# EAGLE design slave (EAGLE 9.2.2)
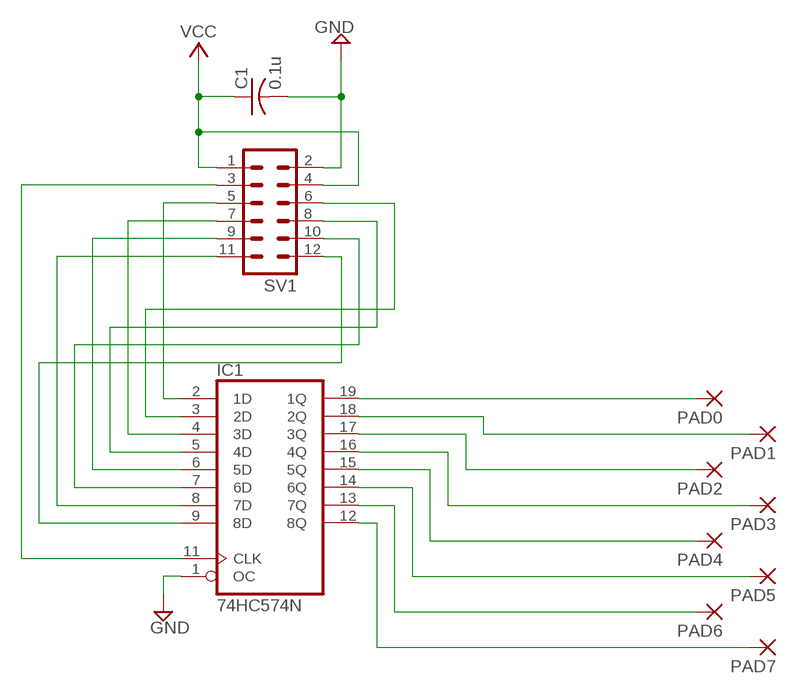
[diagram p0: schematic, sheet 1]

## Parts
C1  0.1u  C-USC0805  [C0805]
IC1  74HC574N  [DIL20]
PAD0  2,54/0,8  [2,54/0,8]
PAD1  2,54/0,8  [2,54/0,8]
PAD2  2,54/0,8  [2,54/0,8]
PAD3  2,54/0,8  [2,54/0,8]
PAD4  2,54/0,8  [2,54/0,8]
PAD5  2,54/0,8  [2,54/0,8]
PAD6  2,54/0,8  [2,54/0,8]
PAD7  2,54/0,8  [2,54/0,8]
SV1  MA06-2  [MA06-2]

## Nets
CLK: IC1.11(CLK) SV1.3
GND: C1.2 IC1.1(OC) SV1.2
IN0: IC1.2(1D) SV1.5
IN1: IC1.3(2D) SV1.6
IN2: IC1.4(3D) SV1.7
IN3: IC1.5(4D) SV1.8
IN4: IC1.6(5D) SV1.9
IN5: IC1.7(6D) SV1.10
IN6: IC1.8(7D) SV1.11
IN7: IC1.9(8D) SV1.12
N$1: IC1.19(1Q) PAD0.1(P)
N$2: IC1.18(2Q) PAD1.1(P)
N$3: IC1.17(3Q) PAD2.1(P)
N$4: IC1.16(4Q) PAD3.1(P)
N$5: IC1.15(5Q) PAD4.1(P)
N$6: IC1.14(6Q) PAD5.1(P)
N$7: IC1.13(7Q) PAD6.1(P)
N$8: IC1.12(8Q) PAD7.1(P)
VCC: C1.1 SV1.1 SV1.4

## Power pins joined to a net without a drawn wire
GND: IC1.10(GND)
VCC: IC1.20(VCC)

## Library data of the parts
C1 = rcl:C-US: CAPACITOR, American symbol; SPICEPREFIX: C
IC1 = 74xx-eu:74*574: 8-bit D type FLIP FLOP bus driver
PAD0 PAD1-PAD7 = wirepad:2,54/0,8: THROUGH-HOLE PAD
SV1 = con-lstb:MA06-2: PIN HEADER; OC_FARNELL: unknown; OC_NEWARK: unknown

## Board
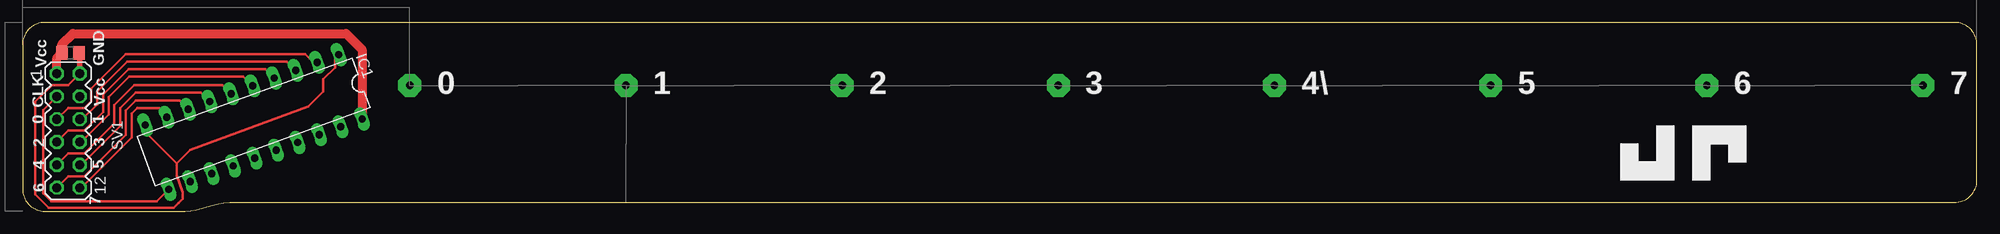
[diagram p1: board, top side]
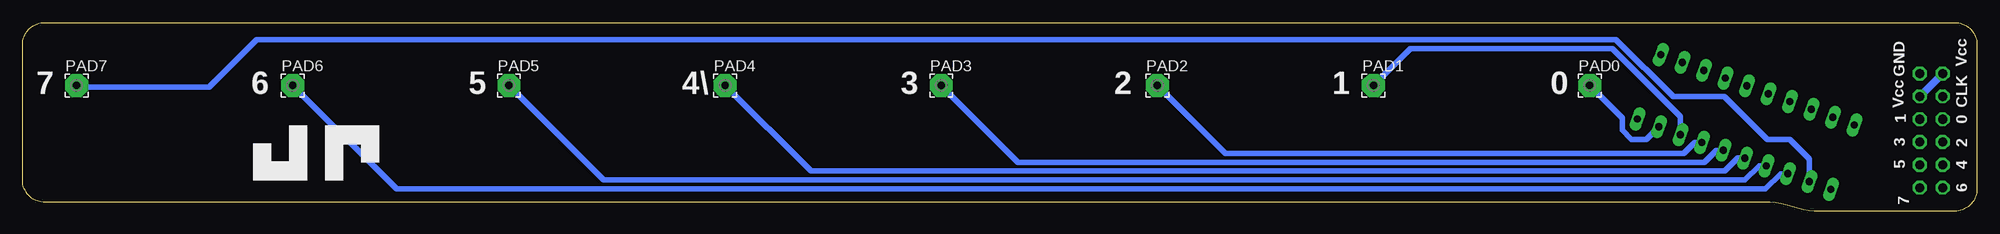
[diagram p2: board, bottom side, seen from below]

Size 217 x 21 mm. Coordinates in mm from the lower left corner, seen from the top.
Outline: 0,18.5 0,2.5 arc90 2.5,0 17.46,0 arc18 20.46,0.49 arc-18 23.62,1 214.5,1 arc90 217,3.4 217,18.5 arc90 214.5,21 2.5,21 arc90 0,18.5
Copper layers (1*16): Top 0.035mm / dielectric 1.5mm / Bottom 0.035mm
Design rules "default *": minimum track width 6mil, minimum drill 0.35mm, track to track 15mil, track to pad 15mil, pad to pad 15mil, via to via 15mil, smd to smd 6mil, copper to edge 10mil, drill to drill 6mil, minimum pad ring 10mil, minimum via ring 8mil, stop-mask expansion 4mil, vias tented up to drill 0mil, thermal gap 10mil

### Footprints (pad centres in the part's own frame; a part is rotated, then mirrored left to right if it is on the bottom)
C0805 = smd 1.3 x 1.5: 1 -0.95,0; 2 0.95,0
DIL20 = drill 0.813 long: 1 -11.43,-3.81; 2 -8.89,-3.81; 3 -6.35,-3.81; 4 -3.81,-3.81; 5 -1.27,-3.81; 6 1.27,-3.81; 7 3.81,-3.81; 8 6.35,-3.81; 9 8.89,-3.81; 10 11.43,-3.81; 11 11.43,3.81; 12 8.89,3.81; 13 6.35,3.81; 14 3.81,3.81; 15 1.27,3.81; 16 -1.27,3.81; 17 -3.81,3.81; 18 -6.35,3.81; 19 -8.89,3.81; 20 -11.43,3.81
2,54/0,8 = drill 0.813 pad 2.54 octagon: 1 0,0
MA06-2 = drill 1.016 octagon: 1 -6.35,-1.27; 2 -6.35,1.27; 3 -3.81,-1.27; 4 -3.81,1.27; 5 -1.27,-1.27; 6 -1.27,1.27; 7 1.27,-1.27; 8 1.27,1.27; 9 3.81,-1.27; 10 3.81,1.27; 11 6.35,-1.27; 12 6.35,1.27

### Placement (x,y rotation side)
C1  5.33,17.63 0 top
IC1  25.66,9.93 200 top
PAD0  43,14 0 bottom
PAD1  67,14 0 bottom
PAD2  91,14 0 bottom
PAD3  115,14 0 bottom
PAD4  139,14 0 bottom
PAD5  163,14 0 bottom
PAD6  187,14 0 bottom
PAD7  211,14 0 bottom
SV1  5.08,8.97 270 top

### Tracks (layer width: path | path; a pad name or v marks a point on that pad's centre or on a via)
CLK
  Top 0.305: SV1.3 2.3,11.27 2.3,2 3.2,1.1 14.88,1.1 IC1.11
GND
  Top 0.254: SV1.2 5.08,14.05 3.28,14.05 1.43,12.2 1.43,1.87 2.9,0.4 16.8,0.4 17.28,0.88 17.3,0.89 17.32,0.92 17.8,1.4 17.8,2.12 17.12,3.99 17.12,5.32 | IC1.1 34.7,17.02 34.7,16 33.4,14.7 33.4,13.3 31.73,11.63 18.6,6.8 17.12,5.32 | 17.12,5.32 13.62,8.82 IC1.10
  Top 0.305: 6.35,17.56 C1.2
  Top 0.61: SV1.2 6.35,17.56
IN0
  Top 0.254: SV1.5 5.08,11.51 6.88,11.51 7.62,12.25 7.62,13.65 11.47,17.5 31.4,17.5 32.35,16.55 IC1.2
IN1
  Top 0.254: SV1.6 6.64,10.24 8.3,11.9 8.3,13.33 11.63,16.66 29.34,16.66 IC1.3
IN2
  Top 0.254: SV1.7 5.08,8.97 6.88,8.97 8.94,11.03 8.94,12.97 11.8,15.83 26.92,15.83 IC1.4
IN3
  Top 0.254: SV1.8 6.5,7.7 9.57,10.77 9.57,12.71 11.86,15 24.5,15 IC1.5
IN4
  Top 0.254: SV1.9 5.08,6.43 6.88,6.43 10.21,9.76 10.21,11.84 12.42,14.06 22.18,14.06 IC1.6
IN5
  Top 0.254: SV1.10 6.5,5.16 10.84,9.5 10.84,11.48 12.59,13.22 19.76,13.22 IC1.7
IN6
  Top 0.254: SV1.11 5.08,3.89 6.88,3.89 11.47,8.49 11.47,11.22 12.56,12.3 17.43,12.3 IC1.8
IN7
  Top 0.254: SV1.12 6.5,2.62 12.11,8.23 12.11,10.9 12.71,11.5 15.2,11.5 16,10.7 IC1.9
N$1
  Bottom 0.61: IC1.19 36.71,8 38.35,8 39.38,9.04 39.38,10.38 PAD0.1
N$2
  Bottom 0.61: IC1.18 32.93,10.53 40.5,18.1 62.9,18.1 PAD1.1
N$3
  Bottom 0.61: IC1.17 31.34,7.65 32.55,6.45 83.44,6.45 PAD2.1
N$4
  Bottom 0.61: IC1.16 28.96,6.78 30.29,5.46 106.45,5.46 PAD3.1
N$5
  Bottom 0.61: IC1.15 26.57,5.92 28.02,4.46 129.46,4.46 PAD4.1
N$6
  Bottom 0.61: IC1.14 24.18,5.05 25.76,3.47 152.47,3.47 PAD5.1
N$7
  Bottom 0.61: IC1.13 21.8,4.18 23.49,2.48 175.48,2.48 PAD6.1
N$8
  Bottom 0.61: IC1.12 18.61,5.81 20.8,8 23.3,8 28.04,12.74 33.74,12.74 40.09,19.09 190.98,19.09 196.27,13.8 210.8,13.8 PAD7.1
VCC
  Top 0.813: IC1.20
  Top 1.016: SV1.1 3.81,17.06 C1.1 4.38,18.58 5.58,19.78 35.92,19.78 37.7,18 IC1.20
  Bottom 0.813: SV1.4 SV1.1

### Text on the board
tNames: Vcc | GND | 0 | 1 | 2 | 3 | 4\ | 5 | 6 | 7 | CLK | Vcc | 0 | 1 | 2 | 3 | 4 | 5 | 6 | 7
bNames: Vcc | GND | 0 | 1 | 2 | 3 | 4\ | 5 | 6 | 7 | CLK | Vcc | 0 | 1 | 2 | 3 | 4 | 5 | 6 | 7
tValues: Created by / Joshua Petrin
bValues: Created by / Joshua Petrin